# Altium project audio_output.PrjPcb
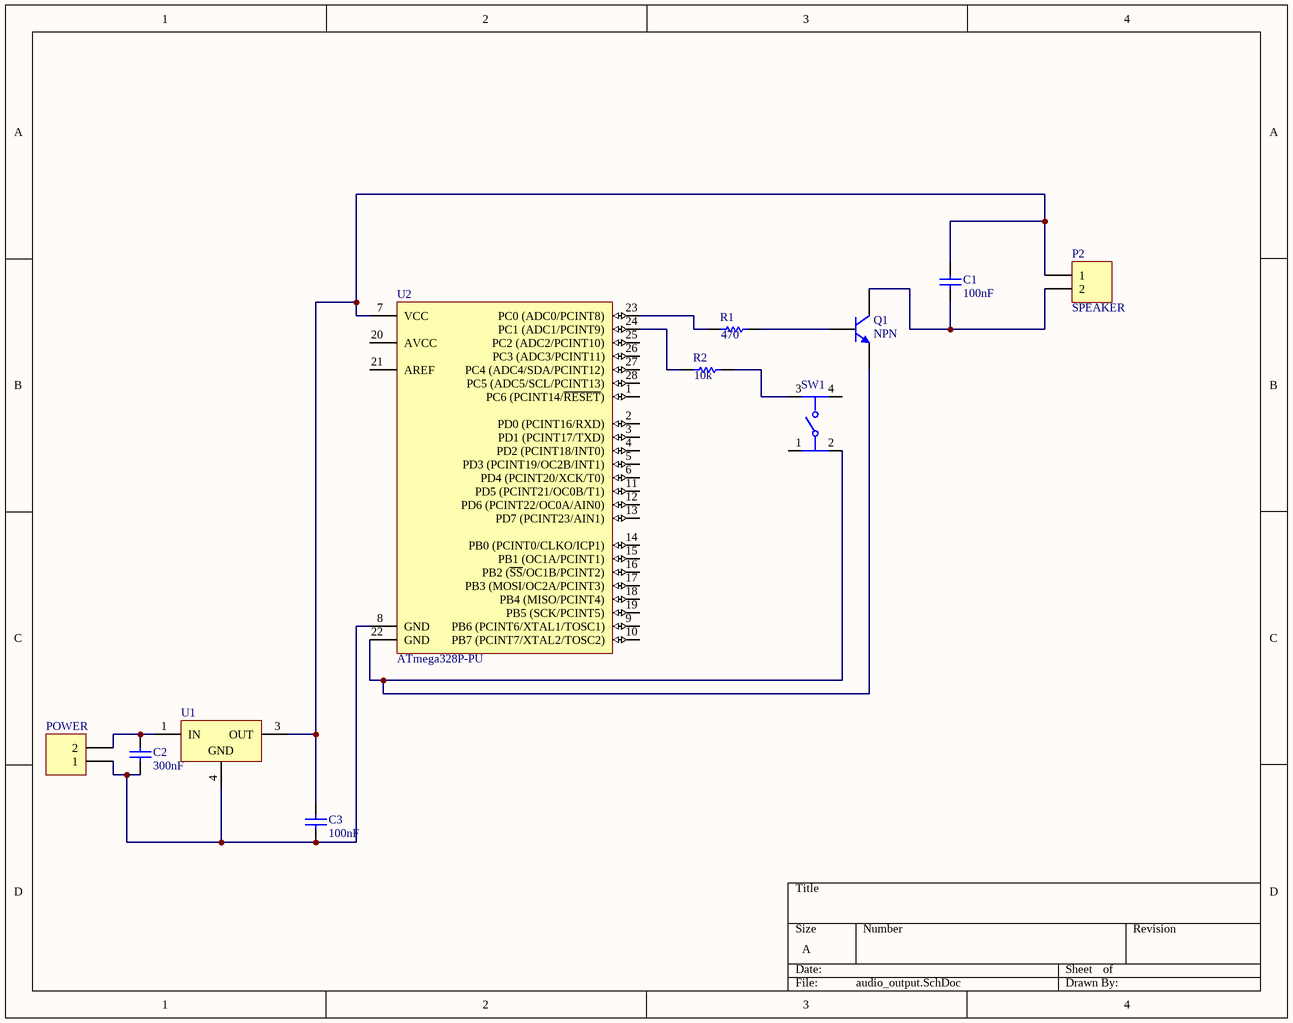
[diagram p0: audio_output.SchDoc]
1 sheet, 11 parts. Net scope: global (net labels, ports and power ports of the same name join across sheets).
Board file: Audio_output.PcbDoc

## Sheet audio_output.SchDoc
size A; SheetNumber: 1; SheetTotal: 1

### Parts
C1  value 100nF  [RAD-0.3]  (hidden comment: Cap)
C2  value 300nF  [RAD-0.3]  (hidden comment: Cap)
C3  value 100nF  [RAD-0.3]  (hidden comment: Cap)
P2  SPEAKER  [HDR1X2]
Q1  NPN  [SOT-23B_N]
R1  value 470  [AXIAL-0.3]  (hidden comment: Res1)
R2  value 10k  [AXIAL-0.3]  (hidden comment: Res1)
SW1  (no value)  [FP-1-1825910-0-MFG]
U1  L7805CD2T-TR  [TO-263_N]  (value not drawn)
U2  ATmega328P-PU  [28P3]
  POWER  [HDR1X2]

### Nets
NetC1_1: C1.1 C3.2 P2.1 U1.3(OUT) U2.7(VCC)
NetC1_2: C1.2 P2.2 Q1.1(C)
NetC2_1: C2.1 U1.1(IN) .2
NetC2_2: C2.2 C3.1 U1.4(GND) U2.8(GND) .1
NetQ1_2: Q1.2(B) R1.2
NetQ1_3: Q1.3(E) SW1.2 U2.22(GND)
NetR1_1: R1.1 U2.23(PC0_(ADC0/PCINT8))
NetR2_1: R2.1 U2.24(PC1_(ADC1/PCINT9))
NetR2_2: R2.2 SW1.3

Not connected (* = marked no-connect by the designer): SW1 1 4; U2 1(PC6_(PCINT14/~{RESET})) 2(PD0_(PCINT16/RXD)) 3(PD1_(PCINT17/TXD)) 4(PD2_(PCINT18/INT0)) 5(PD3_(PCINT19/OC2B/INT1)) 6(PD4_(PCINT20/XCK/T0)) 9(PB6_(PCINT6/XTAL1/TOSC1)) 10(PB7_(PCINT7/XTAL2/TOSC2)) 11(PD5_(PCINT21/OC0B/T1)) 12(PD6_(PCINT22/OC0A/AIN0)) 13(PD7_(PCINT23/AIN1)) 14(PB0_(PCINT0/CLKO/ICP1)) 15(PB1_(OC1A/PCINT1)) 16(PB2_(~{SS}/OC1B/PCINT2)) 17(PB3_(MOSI/OC2A/PCINT3)) 18(PB4_(MISO/PCINT4)) 19(PB5_(SCK/PCINT5)) 20(AVCC) 21(AREF) 25(PC2_(ADC2/PCINT10)) 26(PC3_(ADC3/PCINT11)) 27(PC4_(ADC4/SDA/PCINT12)) 28(PC5_(ADC5/SCL/PCINT13))

### Library data of the parts
C1-C3 = Cap: Capacitor; Published: 8-Jun-2000; LatestRevisionDate: 17-Jul-2002; LatestRevisionNote: Re-released for DXP Platform.; PackageReference: RAD-0.3; Publisher: Altium Limited; PackageDescription: Radial Cap, Thru-Hole; 2 Leads; 0.3 in Pin Spacing
P2  = Header 2: Header, 2-Pin; LatestRevisionDate: 17-Jul-2002; LatestRevisionNote: Re-released for DXP Platform.; Publisher: Altium Limited
Q1 = QNPN: NPN Bipolar Transistor; Published: 8-Jun-2000; LatestRevisionDate: 29-May-2009; LatestRevisionNote: IPC-7351 Footprint Added.; PackageVersion: Aug-1999; PackageReference: SOT-23B; Publisher: Altium Limited; PackageDescription: 3-Pin SOT-23 Package 0.95 mm Pitch, 2.4 mm Lead Span
R1 R2 = Res1: Resistor; Published: 8-Jun-2000; LatestRevisionDate: 17-Jul-2002; LatestRevisionNote: Re-released for DXP Platform.; PackageReference: AXIAL-0.3; Publisher: Altium Limited; PackageDescription: Axial Device, Thru-Hole; 2 Leads; 0.3 in Pin Spacing
SW1 = CMP-03407-000018-1: SWITCH TACTILE SPST-NO 0.05A 24V; Switch Function: Off-Mom; Mechanical Life: 100000Cycles; Actuator Material: Nylon; Actuator Color: Blue; Contact Current Rating: 50mA; Illumination Type: Non-Illuminated; Throw Configuration: SPST; Actuator Length: 3.4mm; Operating Force: 1.56N; Actuator Type: Standard; Contact Resistance: 100mR; Switch Travel: 0.25mm; Depth: 5.99mm; Contact Plating: Silver; Max Operating Temperature: 85°C; Electrical Life: 100000Cycles; Min Operating Temperature: -35°C; RoHS Compliant: Yes; Max Voltage Rating (DC): 24V; Mount: Through Hole; Packaging: Loose Piece; Length: 5.99mm; Series: FSMJ, Alcoswitch; Orientation: Straight; Contact Material: Brass; Radiation Hardening: No; Package Quantity: 750; Max Current Rating: 50mA; Termination: PC Pins; Type: Switch; Voltage Rating (DC): 24V
U1 = CMP-0244-00213-1: Positive Voltage Regulator, 3-Pin D2PAK, Tape and Reel; PackageReference: TO-263; ComponentLink2URL: http://www.st.com/internet/com/TECHNICAL_RESOURCES/TECHNICAL_LITERATURE/DATASHEET/CD00000444.pdf; PackageDescription: 3-Pin Transistor Outline Package 2.54 mm Pitch, 15.4 mm Lead Span (D2PAK); DatasheetVersion: 16/11/2011; ComponentLink2Description: Datasheet; ComponentLink1Description: Manufacturer URL; PackageVersion: 2011; ComponentLink1URL: http://www.st.com
U2 = CMP-0095-00013-2: 8-bit AVR Microcontroller, 32KB Flash, 1KB EEPROM, 2KB SRAM, 28-pin PDIP, Industrial Grade (-40°C to 85°C); RevisionNote: DatasheetVersion updated. URLs added.; PackageVersion: revB, Sep-2001; PackageDescription: 28-lead (0.300"/7.62mm Wide) Plastic Dual Inline Package (PDIP); DatasheetVersion: revD, May-2011; ComponentLink1Description: Manufacturer URL; ComponentLink1URL: http://www.atmel.com/; PackageReference: 28P3; ComponentLink2Description: ATmega48A/48PA/88A/88PA/168A/168PA/328/328P Datasheet; ComponentLink3URL: http://www.atmel.com/dyn/resources/prod_documents/8271S.pdf; ComponentLink2URL: http://www.atmel.com/dyn/resources/prod_documents/8271.pdf; ComponentLink3Description: ATmega48A/48PA/88A/88PA/168A/168PA/328/328P Summary